# Altium project ESE516_ExampleBaseProject_V2.PrjPcb (part 1 of 2)
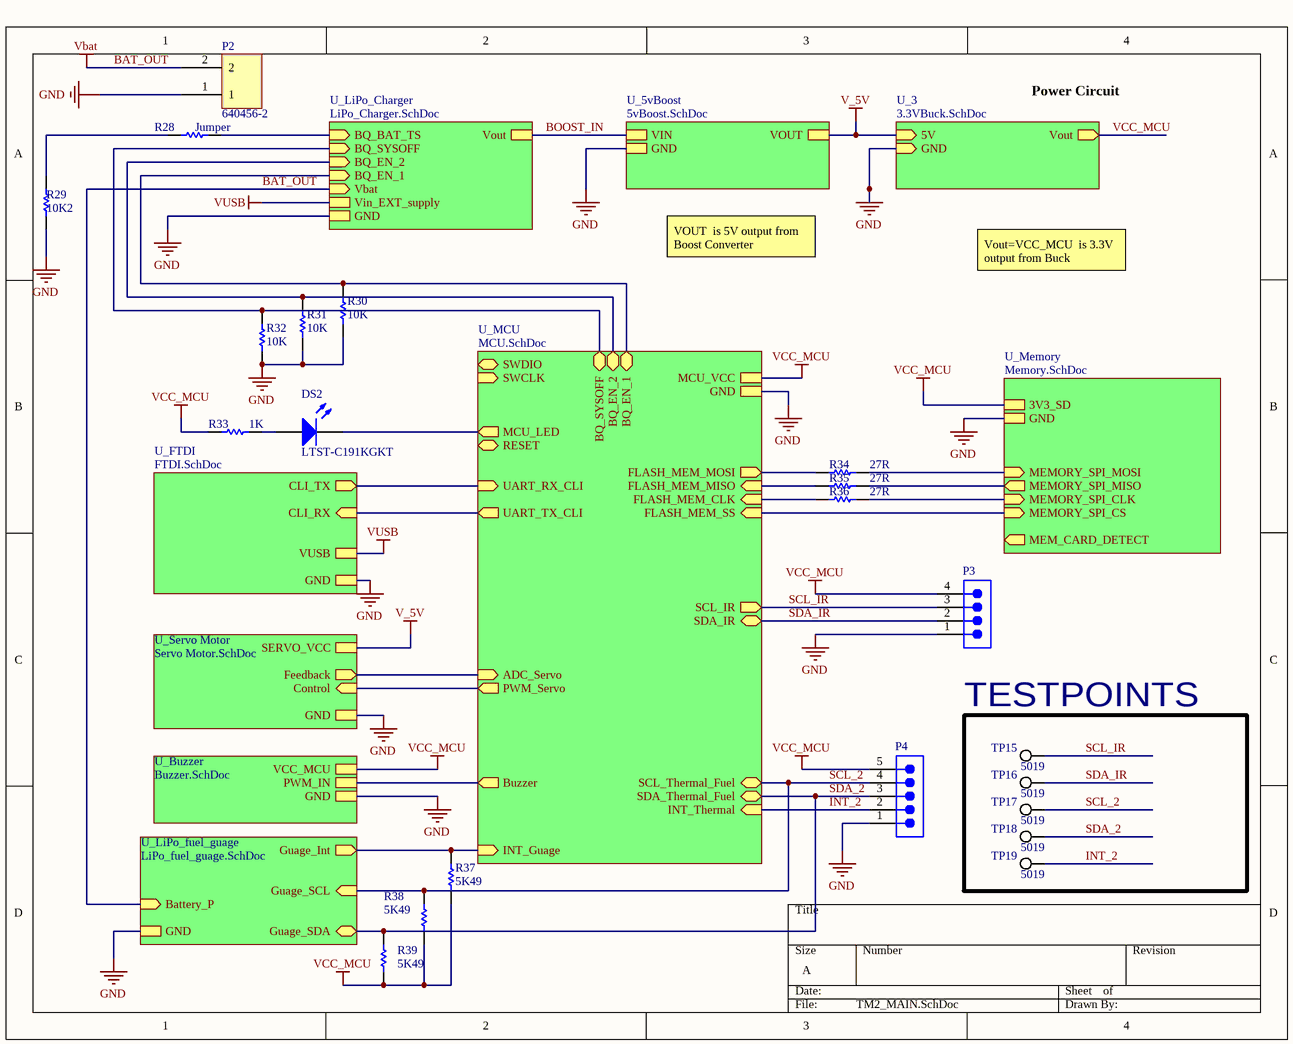
[diagram p0: TM2_MAIN.SchDoc]
10 sheets, 120 parts. Net scope: strictly hierarchical (ports join the sheet entries above them; power ports are local).
Sheets:
  TM2_MAIN.SchDoc
    U_FTDI = FTDI.SchDoc
    U_Memory = Memory.SchDoc
    U_5vBoost = 5vBoost.SchDoc
    U_3 = 3.3VBuck.SchDoc
    U_MCU = MCU.SchDoc
    U_Servo Motor = Servo Motor.SchDoc
    U_LiPo_Charger = LiPo_Charger.SchDoc
    U_LiPo_fuel_guage = LiPo_fuel_guage.SchDoc
    U_Buzzer = Buzzer.SchDoc

## Sheet TM2_MAIN.SchDoc
size A; DrawnBy: Eduardo

### Parts
DS2  LTST-C191KGKT  [LITE-ON-LTST-C191KRKT-2_V]
P2  640456-2  [640456-2]
P3  (no value)  [SMTC-MTSW-104-07-X-S-170]
P4  (no value)  [SMTC-MTLW-105-05-X-S-190]
R28  Jumper  [RESC0603(1608)_N]
R29  10K2  [RESC0805(2012)_L]
R30  10K  [RESC0805(2012)_L]
R31  10K  [RESC0805(2012)_L]
R32  10K  [RESC0805(2012)_L]
R33  1K  [RESC0603(1608)_M]
R34  27R  [RESC0603(1608)_N]
R35  27R  [RESC0603(1608)_N]
R36  27R  [RESC0603(1608)_N]
R37  5K49  [RESC0805(2012)_N]
R38  5K49  [RESC0805(2012)_N]
R39  5K49  [RESC0805(2012)_N]
TP15  5019  [KSTN-5019_V]
TP16  5019  [KSTN-5019_V]
TP17  5019  [KSTN-5019_V]
TP18  5019  [KSTN-5019_V]
TP19  5019  [KSTN-5019_V]

### Blocks framed on the sheet
TESTPOINTS: TP15-TP19

### Sub-sheets
U_3 = 3.3VBuck.SchDoc: 5V (in), GND (in), Vout (out)
U_5vBoost = 5vBoost.SchDoc: VOUT, VIN, GND
U_Buzzer = Buzzer.SchDoc: VCC_MCU, GND, PWM_IN
U_FTDI = FTDI.SchDoc: CLI_RX (in), CLI_TX (out), VUSB, GND
U_LiPo_Charger = LiPo_Charger.SchDoc: BQ_BAT_TS (in), BQ_SYSOFF (in), BQ_EN_2 (in), BQ_EN_1 (in), Vbat (in), Vout, GND, Vin_EXT_supply
U_LiPo_fuel_guage = LiPo_fuel_guage.SchDoc: Guage_SDA (bidir), Guage_SCL (in), Guage_Int (out), Battery_P (in), GND
U_MCU = MCU.SchDoc: SWDIO (bidir), SWCLK (in), UART_TX_CLI (out), FLASH_MEM_SS (in), FLASH_MEM_CLK (in), FLASH_MEM_MISO (in), FLASH_MEM_MOSI (out), RESET (bidir), MCU_LED (out), MCU_VCC, GND, INT_Thermal (in), SDA_IR (bidir), PWM_Servo (out), ADC_Servo (in), SCL_Thermal_Fuel (bidir), SDA_Thermal_Fuel (bidir), SCL_IR (out), UART_RX_CLI (in), BQ_SYSOFF (bidir), BQ_EN_1 (bidir), BQ_EN_2 (bidir), INT_Guage (in), Buzzer (out)
U_Memory = Memory.SchDoc: MEMORY_SPI_MOSI (in), MEMORY_SPI_MISO (out), MEMORY_SPI_CLK (in), MEMORY_SPI_CS (in), MEM_CARD_DETECT (out), GND, 3V3_SD
U_Servo Motor = Servo Motor.SchDoc: SERVO_VCC, Feedback (out), Control (in), GND

### Nets
BOOST_IN: sheet U_5vBoost/VIN, sheet U_LiPo_Charger/Vout  [project net Vin]
GND: P2.1 P3.1 P4.1 R29.1 R30.1 R31.2 R32.2 ; sheet U_FTDI/GND, sheet U_Memory/GND, sheet U_5vBoost/GND, sheet U_3/GND, sheet U_MCU/GND, sheet U_Servo Motor/GND, sheet U_LiPo_Charger/GND, sheet U_LiPo_fuel_guage/GND, sheet U_Buzzer/GND
V_5V: sheet U_5vBoost/VOUT, sheet U_3/5V, sheet U_Servo Motor/SERVO_VCC
Vbat: P2.2 ; sheet U_LiPo_Charger/Vbat, sheet U_LiPo_fuel_guage/Battery_P  [also labelled BAT_OUT]
VCC_MCU: P3.4 P4.5 R33.1 R37.1 R38.1 R39.1 ; sheet U_Memory/3V3_SD, sheet U_3/Vout, sheet U_MCU/MCU_VCC, sheet U_Buzzer/VCC_MCU
VUSB: sheet U_FTDI/VUSB, sheet U_LiPo_Charger/Vin_EXT_supply
BQ_BAT_TS: R28.2 ; sheet U_LiPo_Charger/BQ_BAT_TS
BQ_EN_1: R30.2 ; sheet U_MCU/BQ_EN_1, sheet U_LiPo_Charger/BQ_EN_1
BQ_EN_2: R31.1 ; sheet U_MCU/BQ_EN_2, sheet U_LiPo_Charger/BQ_EN_2
BQ_SYSOFF: R32.1 ; sheet U_MCU/BQ_SYSOFF, sheet U_LiPo_Charger/BQ_SYSOFF
Buzzer: sheet U_MCU/Buzzer, sheet U_Buzzer/PWM_IN
Control: sheet U_MCU/PWM_Servo, sheet U_Servo Motor/Control
Feedback: sheet U_MCU/ADC_Servo, sheet U_Servo Motor/Feedback
FLASH_MEM_SPI_SS: sheet U_Memory/MEMORY_SPI_CS, sheet U_MCU/FLASH_MEM_SS
Guage_Int: R37.2 ; sheet U_MCU/INT_Guage, sheet U_LiPo_fuel_guage/Guage_Int
INT_2: P4.2 TP19.1 ; sheet U_MCU/INT_Thermal
MCU_LED: DS2.2(K) ; sheet U_MCU/MCU_LED
MEM_SPI_CLK: R36.2 ; sheet U_Memory/MEMORY_SPI_CLK
MEM_SPI_MISO: R35.2 ; sheet U_Memory/MEMORY_SPI_MISO
MEM_SPI_MOSI: R34.2 ; sheet U_Memory/MEMORY_SPI_MOSI
SCL_2: P4.4 R38.2 TP17.1 ; sheet U_MCU/SCL_Thermal_Fuel, sheet U_LiPo_fuel_guage/Guage_SCL
SCL_IR: P3.3 TP15.1 ; sheet U_MCU/SCL_IR
SDA_2: P4.3 R39.2 TP18.1 ; sheet U_MCU/SDA_Thermal_Fuel, sheet U_LiPo_fuel_guage/Guage_SDA
SDA_IR: P3.2 TP16.1 ; sheet U_MCU/SDA_IR
SERCOM1_PAD2_SPI_MISO: R35.1 ; sheet U_MCU/FLASH_MEM_MISO
SERCOM1_PAD2_SPI_MOSI: R34.1 ; sheet U_MCU/FLASH_MEM_MOSI
SERCOM1_PAD3_SPI_SCK: R36.1 ; sheet U_MCU/FLASH_MEM_CLK
SERCOM4_UART_RX_CLI: sheet U_FTDI/CLI_TX, sheet U_MCU/UART_RX_CLI
SERCOM4_UART_TX_CLI: sheet U_FTDI/CLI_RX, sheet U_MCU/UART_TX_CLI
NetDS2_1: DS2.1(A) R33.2
NetR28_1: R28.1 R29.2

### Notes on the sheet
- Power Circuit
- VOUT  is 5V output from Boost Converter
- Vout=VCC_MCU  is 3.3V output from Buck Converter

### Library data of the parts
DS2 = CMP-2000-05198-1: Chip LED, Green, 574 nm, 40 pF, -55 to 85 degC, 2-Pin SMD, RoHS, Tape and Reel; Manufacturer: Lite-On; Rad Hardened: No; Emitting Color: YellowGreen; Product Height (mm): 0.55mm; Forward Voltage: 2.4V; Number of Elements: 1; Dominant Wave Length: 571nm; DELETED: Compliant; Viewing Angle: 130deg; High Brightness: Yes; Peak Wavelength: 574nm; Type: Uni-Color; Forward Current: 30mA; Product Length (mm): 1.6mm; Luminous Intensity: 35mcd; Test Current (It): 20mA; Chip Material: AlGaInP; Product Depth (mm): 0.8mm; Shape Type: Rectangular; Reverse Voltage: 5V; Power Dissipation: 75W; Pin Count: 2; Lens Dimensions: 1.1X0.8X0.37mm; Packaging: TapeandReel; Main Category: ChipLED; Operating Temperature Classification: Industrial; Package Type: ChipLed; Mounting: SurfaceMount; Lum Intensity: 35mcd; Operating Temp Range: -55Cto85C; Datasheet Version: Jan-07; Datasheet URL: http://download.siliconexpert.com/pdfs/2007/08/26/semi_b/manual/lot/ds/ltst-c191kgkt.pdf; Manufacturer URL: http://www.us.liteon.com/
P2 = 640456-2: CONN HEADER VERT 2POS .100 TIN; Manufacturer: TE Connectivity; Underplate Material: Nickel; Connector Type: Plug,Pin,Header; Contact Resistance: 6mR; Max Current Rating: 5A; Max Voltage Rating (AC): 250V; Number of Positions: 2; Backwall/Post Interruptions: No (Without); Connector System: Wire-to-Board; Plating Thickness: 3.81um; PCB Mount Retention: Without; Gender: Male; Contact Style: Straight; PCB Mounting Orientation: Vertical; Pitch: 2.54mm; Mating Post Length: 7.49mm; PCB Thickness: 0.063inch; Tail Length: 3.56mm; Approvals: CSA; Supplier 1: Digi-Key; Manufacturer Part Number: 640456-2; Stock 1: 141304; Pricing 1: 1=0.12, 10=0.117, 100=0.0724, 500=0.0599, 1000=0.0524, 5000=0.0449, 10000=0.0437 (USD); Mount: Through Hole; Colour: White,Natural,Beige; Contact Plating: Tin; Contact Material: Copper Alloy; Housing Colour: Natural; Housing Material: Polyester; Contact Shape: Square; Min Operating Temperature: -67°C; Max Operating Temperature: 221°C; Package Quantity: 5000; Packaging: Bulk; Termination: Solder; Number of Rows: 1; Fastening Type: Friction; Contact Gender: Male; Voltage Rating (AC): 250V; Number of Contacts: 2; Orientation: Straight; Contact Retention: No (Without); Mating Alignment: No (Without); Mating Retention: No (Without); PCB Mount Alignment: No (Without); Panel Mount Retention: No (Without); Sealable: No (Without); Strain Relief: No (Without); Current Rating: 5A; Number of Poles: 2; Voltage Rating: 250V; Working Voltage: 250V; Length: 5.08mm; Height: 7.87mm; Depth: 5.72mm; Lead Pitch: 2.54mm; Contact Mating Length: 0.295inch; Termination Post Length: 3.56mm; Radiation Hardening: No; ELV: Compliant; Lead Free: Lead Free; Flammability Rating: UL94 V-0; REACH SVHC: No SVHC; ComponentLink1URL: https://datasheet.ciiva.com/709/eng-cd-640456-w1-709680.pdf; ComponentLink1Description: https://datasheet.ciiva.com/709/eng-cd-640456-w1-709680.pdf; ComponentLink2URL: https://datasheet.ciiva.com/3118/eng-ds-82056-mta-0608-3118497.pdf; ComponentLink2Description: https://datasheet.ciiva.com/3118/eng-ds-82056-mta-0608-3118497.pdf; ComponentLink3URL: https://datasheet.ciiva.com/19462/613931-19462481.pdf; ComponentLink3Description: https://datasheet.ciiva.com/19462/613931-19462481.pdf; ComponentLink4URL: https://datasheet.ciiva.com/14156/04384301-14156820.pdf; ComponentLink4Description: https://datasheet.ciiva.com/14156/04384301-14156820.pdf; ComponentLink5URL: https://datasheet.ciiva.com/7128/1866390-7128742.pdf; ComponentLink5Description: https://datasheet.ciiva.com/7128/1866390-7128742.pdf; ComponentLink6URL: https://datasheet.ciiva.com/16401/eng-ds-82056-mta-0608-16401289.pdf; ComponentLink6Description: https://datasheet.ciiva.com/16401/eng-ds-82056-mta-0608-16401289.pdf; ComponentLink7URL: https://datasheet.ciiva.com/16505/eng-ds-82056-mta-0608-16505419.pdf; ComponentLink7Description: https://datasheet.ciiva.com/16505/eng-ds-82056-mta-0608-16505419.pdf; ComponentLink8URL: https://datasheet.ciiva.com/25617/0900766b80027008-25617244.pdf; ComponentLink8Description: https://datasheet.ciiva.com/25617/0900766b80027008-25617244.pdf; ComponentLink9URL: https://datasheet.ciiva.com/11746/0900766b80eb7fdd-11746365.pdf; ComponentLink9Description: https://datasheet.ciiva.com/11746/0900766b80eb7fdd-11746365.pdf; Supplier Part Number 1: A1921-ND
P3 = CMP-1024-00107-1: Manufacturer: Samtec; PartNumber: MTSW-104-07-L-S-170; Pitch: 2.54 mm; PackageVersion: BI, 2/1987; ComponentLink1URL: http://www.samtec.com; PackageReference: MTSW-104-07-X-S-170; ComponentLink3Description: Package Specification; Temperature Range: -55 to 125 degC; ComponentLink2URL: http://www.samtec.com/documents/webfiles/pdf/MTSW.PDF; RoHS: True; Orientation: Vertical; DatasheetVersion: F-214; Mounting Technology: Through-hole; ComponentLink1Description: Manufacturer URL; ComponentLink2Description: Datasheet; ComponentLink3URL: http://www.samtec.com/documents/webfiles/cpdf/MTSW-XXX-XX-X-X-XXXX-XX-XXX-MKT1.pdf
P4 = CMP-1024-00079-1: Manufacturer: Samtec; PartNumber: MTLW-105-05-L-S-190; Pitch: 2.54 mm; Mounting Technology: Through-hole; ComponentLink2Description: Datasheet; DatasheetVersion: F-214; Temperature Range: -55 to 125 degC; ComponentLink1Description: Manufacturer URL; Orientation: Vertical; ComponentLink2URL: http://www.samtec.com/documents/webfiles/pdf/MTLW_TH.PDF; PackageDescription: Low Profile Terminal Assembly; PackageVersion: T, 6/1991; RoHS: True; ComponentLink3Description: Package Specification; ComponentLink1URL: http://www.samtec.com; PackageReference: MTLW-105-05-X-S-190; ComponentLink3URL: http://www.samtec.com/documents/webfiles/cpdf/MTLW-1XX-XX-XX-X-XXX-XX-XX-MKT1.pdf
R28 = CMP-1012-00001-1: Jumper 0603 (1608 Metric); Case-Metric: 1608; Value: 0.00 Ohm; Power: None; Case-EIA: 0603; Technology: SMT; Tolerance: None
R29-R32 = CMP-1013-00624-1: 10K2 0.125W 1% 0805 (2012 Metric)  SMD; Case-Metric: 2012; Case-EIA: 0805; Value: 10200.00 Ohm; Technology: SMT; Tolerance: 1 %; Power: 0.125 W
R33 = CMP-1012-00510-1: 1K 0.1W 1% 0603 (1608 Metric)  SMD; Case-Metric: 1608; Case-EIA: 0603; Value: 1000.00 Ohm; Technology: SMT; Tolerance: 1 %; Power: 0.1 W
R34-R36 = CMP-1012-00331-1: 27R 0.1W 1% 0603 (1608 Metric)  SMD; Case-EIA: 0603; Value: 27.00 Ohm; Case-Metric: 1608; Technology: SMT; Tolerance: 1 %; Power: 0.1 W
R37-R39 = CMP-1013-00594-1: 5K49 0.125W 1% 0805 (2012 Metric)  SMD; Case-Metric: 2012; Value: 5490.00 Ohm; Case-EIA: 0805; Tolerance: 1 %; Power: 0.125 W; Technology: SMT
TP15-TP19 = CMP-1672-00008-1: Test Point, 1 Position SMD, RoHS, Tape and Reel; ComponentLink1Description: Manufacturer URL; Package Quantity: 1000; DatasheetVersion: 03/2014; Packaging: Tape and Reel; ComponentLink2URL: http://www.keyelco.com/product-pdf.cfm?p=1357; ComponentLink1URL: http://www.keyelco.com/; Mount: Surface Mount; Contact Plating: Silver; PackageDescription: 1-Pin Surface Mount Device, Body 3.81 x 2.03 mm; Pins: 1; RoHSCompliant: True; Mounting Technology: Surface Mount; ComponentLink2Description: Datasheet; PackageReference: 5019

## Sheet FTDI.SchDoc
size A
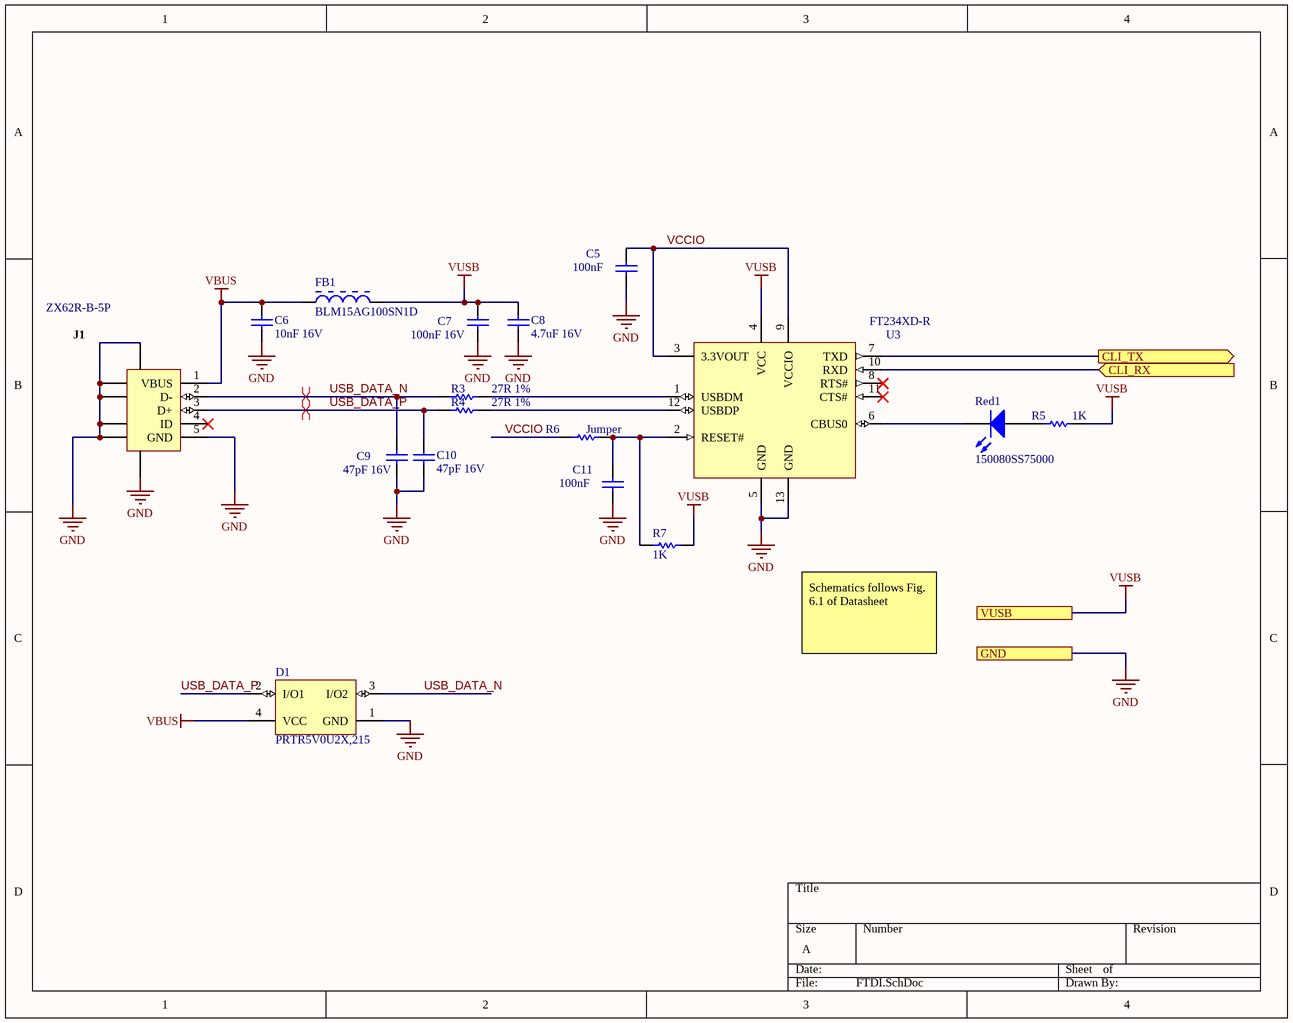
[diagram p1: FTDI.SchDoc]

### Parts
C5  100nF  [CAPC0402(1005)60_N]
C6  10nF 16V  [CAPC0603(1608)100_L]
C7  100nF 16V  [CAPC0603(1608)100_N]
C8  4.7uF 16V  [CAPC0805(2012)145_N]
C9  47pF 16V  [CAPC0603(1608)100_L]
C10  47pF 16V  [CAPC0603(1608)100_L]
C11  100nF  [CAPC0402(1005)60_N]
D1  PRTR5V0U2X,215  [NXP-SOT143B-4_V]
FB1  BLM15AG100SN1D  [MURA-BLM15-CHIP-2_V]
J1  ZX62R-B-5P  [HIRO-ZX62R-B-5P_V]
R3  27R 1%  [RESC0603(1608)_N]
R4  27R 1%  [RESC0603(1608)_N]
R5  1K  [RESC0603(1608)_M]
R6  Jumper  [RESC0603(1608)_N]
R7  1K  [RESC0603(1608)_M]
Red1  150080SS75000  [0805_A]
U3  FT234XD-R  [DFN-12_V]

### Ports
CLI_RX (in), CLI_TX (out), GND, VUSB

### Nets
GND: C5.1 C6.1 C7.1 C8.1 C9.1 C10.1 C11.1 D1.1(GND) J1.5(GND) J1.6(SHLD) J1.7(SHLD) J1.8(SHLD) J1.9(SHLD) J1.10(SHLD) J1.11(SHLD) U3.5(GND) U3.13(GND) ; port GND
VBUS: C6.2 D1.4(VCC) FB1.1 J1.1(VBUS)
VUSB: C7.2 C8.2 FB1.2 R5.2 R7.1 U3.4(VCC) ; port VUSB
SERCOM4_UART_RX_CLI: U3.7(TXD) ; port CLI_TX
SERCOM4_UART_TX_CLI: U3.10(RXD) ; port CLI_RX
USB_DATA_N: C9.2 D1.3(I/O2) J1.2(D-) R3.1
USB_DATA_P: C10.2 D1.2(I/O1) J1.3(D+) R4.1
VCCIO: C5.2 R6.1 U3.3(3.3VOUT) U3.9(VCCIO)
NetC11_2: C11.2 R6.2 R7.2 U3.2(RESET#)
NetR3_2: R3.2 U3.1(USBDM)
NetR4_2: R4.2 U3.12(USBDP)
NetR5_1: R5.1 Red1.2(A)
NetRed1_1: Red1.1(K) U3.6(CBUS0)

Not connected (* = marked no-connect by the designer): J1 4(ID)*; U3 8(RTS#)* 11(CTS#)*

### Layout directives
differential pair: USB_DATA_N, USB_DATA_P

### Notes on the sheet
- Schematics follows Fig. 6.1 of Datasheet

### Library data of the parts
C5 C11 = CMP-1034-02062-1: CAP 100nF 6.3V ±20% 0402 (1005 Metric) Thickness 0.6mm SMD; Case-EIA: 0402; Tolerance: Â±20%; Case-Metric: 1005; Value: 100nF; Technology: SMT; Max Thickness: 0.6 mm; Rated Voltage: 6.3 V
C6 = CMP-1035-02311-1: CAP 10nF 16V ±10% 0603 (1608 Metric) Thickness 1mm SMD; Case-EIA: 0603; Case-Metric: 1608; Tolerance: Â±10%; Rated Voltage: 16 V; Value: 10nF; Max Thickness: 1 mm; Technology: SMT
C7 = CMP-1035-02584-1: CAP 100nF 16V ±10% 0603 (1608 Metric) Thickness 1mm SMD; Tolerance: Â±10%; Case-EIA: 0603; Case-Metric: 1608; Technology: SMT; Max Thickness: 1 mm; Value: 100nF; Rated Voltage: 16 V
C8 = CMP-1036-04889-1: CAP 4.7uF 16V ±10% 0805 (2012 Metric) Thickness 1.45mm SMD; Case-EIA: 0805; Case-Metric: 2012; Tolerance: Â±10%; Technology: SMT; Value: 4.7uF; Rated Voltage: 16 V; Max Thickness: 1.45 mm
C9 C10 = CMP-1035-01048-1: CAP 47pF 16V ±0.5pF 0603 (1608 Metric) Thickness 1mm SMD; Case-EIA: 0603; Case-Metric: 1608; Tolerance: Â±0.5pF; Technology: SMT; Value: 47pF; Rated Voltage: 16 V; Max Thickness: 1 mm
D1 = CMP-2000-05285-1: Ultra Low Capacitance Double Rail-to-Rail ESD Protection Diode, 5.5 V, 1 pF, -40 to 85 degC, 4-Pin SOT143B, RoHS, Tape and Reel; Manufacturer: NXP Semiconductors; Capacitance Value: 16pF; Number of Elements: 1; Rad Hardened: No; Reverse Breakdown Voltage: 6V; Working Voltage (Max): 5.5V; Polarity: Uni-Directional; Configuration: Quad; Leakage Current: 0.1uA; Product Height (mm): 1mm; Suppressor Type: DiodeArrays; Product Length (mm): 3mm; Product Depth (mm): 1.4mm; ESD Protection Voltage: 8KV@ContactDisc; Package Type: SOT; Mounting: SurfaceMount; Packaging: TapeandReel; Datasheet Version: Rev. 02, 01/2008; Reverse Stand-off Voltage: 5.5V; Manufacturer URL: http://www.nxp.com/; Operating Temp Range: -40Cto85C; Operating Temperature Classification: Industrial; Working Voltage: 5.5V; Operating Temperature Min Deg. C: -40C; Datasheet URL: https://datasheet.ciiva.com/4479/prtr5v0u2x-102853-4479461.pdf; Leakage Current (Max): 0.1uA; Direction Type: Uni-Directional; Pin Count: 3+Tab; Operating Temperature Max Deg. C: 85C; Mounting Style: SurfaceMount; Package / Case: SOT
FB1 = CMP-0686-00176-3: Chip Ferrite Bead for General Use, 10 Ohm, 1000 mA, -55 to 125 degC, 1 x 0.5 x 0.55 mm SMD, Tape and Reel; Manufacturer: Murata; Impedance (at 100 MHz): 10 Ohm Typ.; Rated Current: 1000 mA; DC Resistance: 0.025 Ohm Max.; PackageDescription: 2-Pin Chip, Body 1 x 0.5 mm; DatasheetVersion: 08/2013; Mounting Technology: Surface Mount; ComponentLink2URL: http://www.murata.com/products/catalog/pdf/c31e.pdf; Packing: Tape and Reel; ComponentLink1URL: http://www.murata.com/; PartNumber: BLM15AG100SN1D; ComponentLink1Description: Manufacturer URL; Operating Temperature Range: -55 to 125 degC; ComponentLink2Description: Datasheet; ComponentLink3Description: Package Specification; PackageReference: BLM15-2; ComponentLink3URL: http://www.murata.com/products/catalog/pdf/c31e.pdf
J1 = CMP-0031-00001-1: Connector; USBMicro-B,Reverse type, SMT; 5 Position; Right Angle; DatasheetVersion: 08/2010; Operating Temperature: -30 to 85 degC; Mounting Technology: Surface Mount; PartNumber: ZX62R-B-5P; PackageReference: ZX62R-B-5P; ComponentLink2URL: http://www.hirose.co.jp/cataloge_hp/e24200011.pdf; ComponentLink1URL: http://www.hirose.com/â€Ž; ComponentLink2Description: Datasheet; PackageDescription: 5-Pin USB Micro-B R/A Connector; ComponentLink1Description: Manufacturer URL
R3 R4 = CMP-1012-00331-1: as R34 on sheet TM2_MAIN; Technology: SMT; Tolerance: 1 %; Power: 0.1 W
R5 R7 = CMP-1012-00510-1: as R33 on sheet TM2_MAIN; Technology: SMT; Tolerance: 1 %; Power: 0.1 W
R6 = CMP-1012-00001-1: as R28 on sheet TM2_MAIN; Technology: SMT; Tolerance: None
Red1 = CMP-1426-00010-1: SMD mono-color Chip LED, WL-SMCW, Super Red; Manufacturer: Wuerth Elektronik; PackageReference: 0805_A; ComponentLink2URL: http://katalog.we-online.com/led/datasheet/150080SS75000.pdf; ComponentLink1URL: http://www.we-online.com; Color: Super Red; ComponentLink2Description: Datasheet; ComponentLink1Description: Manufacturer URL; PartNumber: 150080SS75000
U3 = CMP-0248-00027-1: FT234XD USB to BASIC UART IC, -40 to +85 degC, 12-Pin DFN, Pb-Free, Tape and Reel; Manufacturer: FTDI; PackageReference: DFN-12; PackageVersion: Feb-13; DatasheetVersion: ver 1.1, Feb-2013; ComponentLink1URL: http://www.ftdichip.com/; PartNumber: FT234XD-R; ComponentLink2URL: http://www.ftdichip.com/Support/Documents/DataSheets/ICs/DS_FT234XD.pdf; ComponentLink1Description: Manufacturer URL; PackageDescription: 12-Pin Dual Flat No-Lead, 3 x 3 mm Body, 0.45 mm Pitch, Exposed Pad; ComponentLink2Description: Datasheet

## Sheet Memory.SchDoc
size A
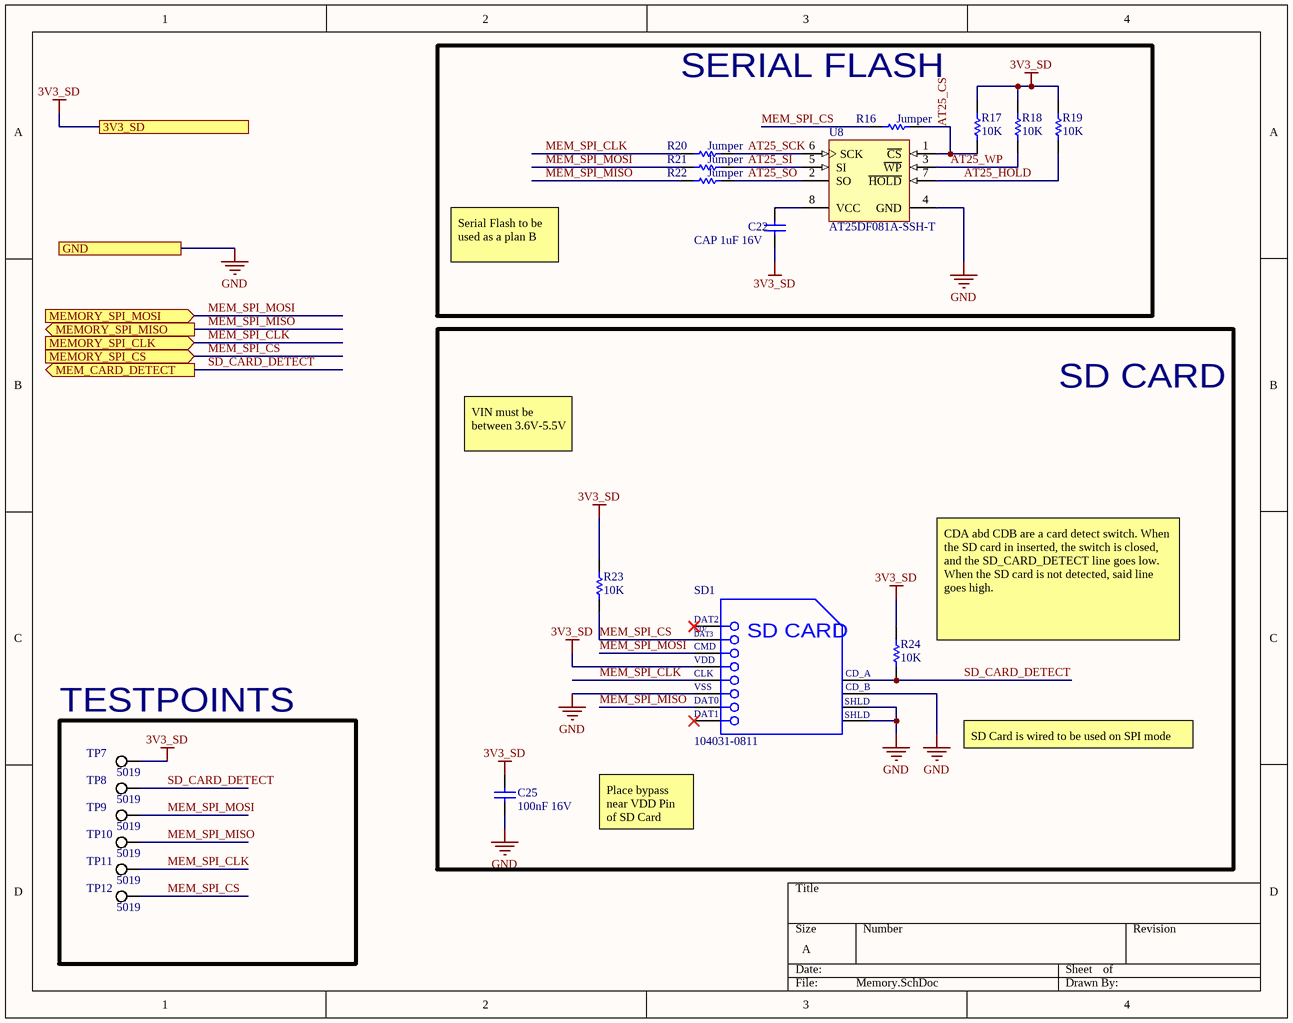
[diagram p2: Memory.SchDoc]

### Parts
C22  CAP 1uF 16V  [CAPC0603(1608)100_N]
C25  100nF 16V  [CAPC0603(1608)100_N]
R16  Jumper  [RESC0603(1608)_N]
R17  10K  [RESC0402(1005)_M]
R18  10K  [RESC0402(1005)_M]
R19  10K  [RESC0402(1005)_M]
R20  Jumper  [RESC0603(1608)_N]
R21  Jumper  [RESC0603(1608)_N]
R22  Jumper  [RESC0603(1608)_N]
R23  10K  [RESC0402(1005)_M]
R24  10K  [RESC0402(1005)_M]
SD1  104031-0811  [MOLX-104031-0811_V]
TP7  5019  [KSTN-5019_V]
TP8  5019  [KSTN-5019_V]
TP9  5019  [KSTN-5019_V]
TP10  5019  [KSTN-5019_V]
TP11  5019  [KSTN-5019_V]
TP12  5019  [KSTN-5019_V]
U8  AT25DF081A-SSH-T  [AT25DF081A-SSH-T]

### Blocks framed on the sheet
SERIAL FLASH: C22 R16-R22 U8
SD CARD: C25 R23 R24 SD1
TESTPOINTS: TP7-TP12

### Ports
3V3_SD, GND, MEM_CARD_DETECT (out), MEMORY_SPI_CLK (in), MEMORY_SPI_CS (in), MEMORY_SPI_MISO (out), MEMORY_SPI_MOSI (in)

### Nets
3V3_SD: C22.1 C25.2 R17.1 R18.1 R19.1 R23.1 R24.1 SD1.4(VDD) TP7.1 ; port 3V3_SD  [project net VCC_MCU]
GND: C25.1 SD1.6(VSS2) SD1.10(CD_B) SD1.11(SHLD1) SD1.12(SHLD2) U8.4(GND) ; port GND
AT25_CS: R16.2 R17.2 U8.1(~{CS})
AT25_HOLD: R19.2 U8.7(~{HOLD})
AT25_SCK: R20.2 U8.6(SCK)
AT25_SI: R21.2 U8.5(SI)
AT25_SO: R22.2 U8.2(SO)
AT25_WP: R18.2 U8.3(~{WP})
MEM_SPI_CLK: R20.1 SD1.5(CLK) TP11.1 ; port MEMORY_SPI_CLK
MEM_SPI_CS: R16.1 R23.2 SD1.2(CMD) TP12.1 ; port MEMORY_SPI_CS  [project net FLASH_MEM_SPI_SS]
MEM_SPI_MISO: R22.1 SD1.7(DAT0) TP10.1 ; port MEMORY_SPI_MISO
MEM_SPI_MOSI: R21.1 SD1.3(VSS1) TP9.1 ; port MEMORY_SPI_MOSI
SD_CARD_DETECT: R24.2 SD1.9(CD_A) TP8.1 ; port MEM_CARD_DETECT
NetC22_2: C22.2 U8.8(VCC)

Not connected (* = marked no-connect by the designer): SD1 1(CD/DAT3)* 8(DAT1)*

### Notes on the sheet
- Serial Flash to be used as a plan B
- VIN must be between 3.6V-5.5V
- (near R24) CDA abd CDB are a card detect switch. When the SD card in inserted, the switch is closed, and the SD_CARD_DETECT line goes low. When the SD card is not detected, said line goes high.
- SD Card is wired to be used on SPI mode
- Place bypass near VDD Pin of SD Card
- (in symbol CMP-2000-05825-1) DAT2; CD/; DAT3; SD CARD; VSS; SHLD

### Library data of the parts
C22 = CMP-1035-02737-1: CAP 1uF 16V ±10% 0603 (1608 Metric) Thickness 1mm SMD; Case-Metric: 1608; Tolerance: Â±10%; Case-EIA: 0603; Rated Voltage: 16 V; Max Thickness: 1 mm; Technology: SMT; Value: 1uF
C25 = CMP-1035-02584-1: as C7 on sheet FTDI; Technology: SMT; Max Thickness: 1 mm; Value: 100nF; Rated Voltage: 16 V
R16 R20-R22 = CMP-1012-00001-1: as R28 on sheet TM2_MAIN; Technology: SMT; Tolerance: None
R17-R19 R23 R24 = CMP-1011-00098-1: 10K 0.063W 5% 0402 (1005 Metric)  SMD; Case-Metric: 1005; Value: 10000.00 Ohm; Case-EIA: 0402; Technology: SMT; Tolerance: 5 %; Power: 0.063 W
SD1 = CMP-2000-05825-1: Micro SD Card, RA, -25 to 85 degC, 8-Pin SMD, RoHS, Tape and Reel; Voltage Rating: 10VAC/DC; Number of Contacts: 8; Insertion - Extraction Style: Push-Pull; Pitch: 1.1mm; Mating Cycles: 10000; Brand: Molex; Current Rating: 500mA; Manufacturer URL: http://www.molex.com/; Card Type: microSD; Mounting Type: Standard; Height: 1.42mm; Mounting Technology: SurfaceMount; Contact Plating: Gold; Product Category: MemoryCardConnectors; Package Description: 8-Pin Surface Mount Device, Body 11.95 x 11.4 mm, Pitch 1.1 mm; Datasheet URL: http://www.molex.com/pdm_docs/sd/1040310811_sd.pdf; Termination Style: SMD; Length: 11.4mm; Housing Material: LiquidCrystalPolymer(LCP); Orientation: RightAngle; RoHS: True; Contact Material: PhosphorBronze; Datasheet Version: Rev. E, 04/2006; Packaging: Reel; Manufacturer: Molex; Series: 104031; Product: CardConnectors; Number of Rows: 1Row; Package Reference: 104031-0811
TP7-TP12 = CMP-1672-00008-1: as TP15 on sheet TM2_MAIN; ComponentLink1Description: Manufacturer URL; Package Quantity: 1000; DatasheetVersion: 03/2014; Packaging: Tape and Reel; ComponentLink2URL: http://www.keyelco.com/product-pdf.cfm?p=1357; ComponentLink1URL: http://www.keyelco.com/; Mount: Surface Mount; Contact Plating: Silver; PackageDescription: 1-Pin Surface Mount Device, Body 3.81 x 2.03 mm; Pins: 1; RoHSCompliant: True; Mounting Technology: Surface Mount; ComponentLink2Description: Datasheet; PackageReference: 5019
U8 = AT25DF081A-SSH-T: IC FLASH 8MBIT 100MHZ 8SOIC; Manufacturer: Adesto Technologies; Memory Size: 8M (4096 pages x 256 bytes); Interface: SPI, RapidS; Voltage - Supply: 2.7 V ~ 3.6 V; Rad Hard: No; Manufacturer Part Number: AT25DF081A-SSH-T; RoHS: RoHS Compliant; Category: Integrated Circuits (ICs); Packaging: Cut Tape (CT); Part Status: Active; Format - Memory: FLASH; Memory Type: FLASH; Speed: 100MHz; Operating Temperature: -40°C ~ 85°C (TC); Package / Case: 8-SOIC (0.154", 3.90mm Width); Supplier Device Package: 8-SOIC; ComponentLink1URL: http://www.adestotech.com/wp-content/uploads/doc8715.pdf; ComponentLink1Description: http://www.adestotech.com/wp-content/uploads/doc8715.pdf; Supplier 1: Digikey; Stock 1: 2550; Pricing 1: 1=1.18, 10=1.081, 25=1.0516, 50=1.0462, 100=0.9352, 250=0.9324, 500=0.9185, 1000=0.8791 (USD); Package: 8SOIC; ComponentLink2URL: https://datasheet.ciiva.com/14084/doc8715-14084443.pdf; ComponentLink2Description: https://datasheet.ciiva.com/14084/doc8715-14084443.pdf; ComponentLink3URL: https://datasheet.ciiva.com/26910/getdatasheetpartid-730210-26910875.pdf; ComponentLink3Description: https://datasheet.ciiva.com/26910/getdatasheetpartid-730210-26910875.pdf; ComponentLink4URL: https://datasheet.ciiva.com/12251/doc8715-12251468.pdf; ComponentLink4Description: https://datasheet.ciiva.com/12251/doc8715-12251468.pdf; Supplier Part Number 1: 1265-1166-1-ND

## Sheet 5vBoost.SchDoc
size A
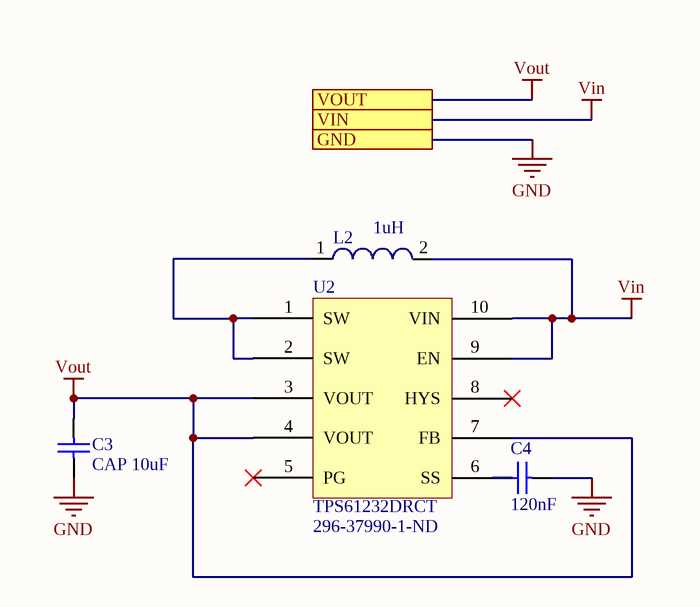
[diagram p3: 5vBoost.SchDoc]

### Parts
C3  CAP 10uF  [CAPC0805(2012)145_L]
C4  120nF  [CAPC2013X140X50ML20T25]
L2  1uH  [SMD 2510]
U2  TPS61232DRCT  Supplier Part Number 1: 296-37990-1-ND  [*SON50P300X300X100-10N]

### Ports
GND, VIN, VOUT

### Nets
GND: C3.1 C4.2 ; port GND
Vin: L2.2 U2.9(EN) U2.10(VIN) ; port VIN
Vout: C3.2 U2.3(VOUT) U2.4(VOUT) U2.7(FB) ; port VOUT  [project net V_5V]
NetC4_1: C4.1 U2.6(SS)
NetL2_1: L2.1 U2.1(SW) U2.2(SW)

Not connected (* = marked no-connect by the designer): U2 5(PG)* 8(HYS)*

### Library data of the parts
C3 = CMP-1036-04927-1: CAP 10uF 16V ±10% 0805 (2012 Metric) Thickness 1.45mm SMD; Case-EIA: 0805; Tolerance: Â±10%; Case-Metric: 2012; Rated Voltage: 16 V; Technology: SMT; Value: 10uF; Max Thickness: 1.45 mm
C4 = CMP-2007-04709-1: Manufacturer: AVX Interconnect / Elco; Part Number: 08055C124KAT2A
L2 = CMP-1411-00009-1: Power Multilayer Inductor WE-MAPI, L=1.0µH; Manufacturer: Wuerth Elektronik; PartNumber: 74438323010; Inductance: 1.0ÂµH; ComponentLink2URL: http://katalog.we-online.de/kataloge/eisos/media/pdf/74438323010.pdf; ComponentLink1URL: http://www.we-online.com; PackageReference: SMD 2510; ComponentLink2Description: Datasheet; ComponentLink1Description: Manufacturer URL
U2 = TPS61232DRCT: Manufacturer: Texas Instruments; Min Input Voltage: 2.3V; Max Input Voltage: 5.5V; Output Current: 2.1A; Number of Outputs: 1; Output Voltage: 5V; Efficiency: 96%; Switching Frequency: 2MHz; Quiescent Current: 35uA; Topology: Boost; Output Type: Fixed; Synchronous Rectifier: Yes; Output Configuration: Positive; Supplier 1: Digi-Key; Manufacturer Part Number: TPS61232DRCT; RoHS: Yes; Stock 1: 5502; Pricing 1: 1 = 2.92000, 10 = 2.62600, 100 = 2.11050 (USD); Mount: Surface Mount; Number of Pins: 10; Weight: 0.000921oz; Contact Plating: Gold; Min Operating Temperature: -40°C; Max Operating Temperature: 85°C; Max Output Current: 2.1A; Operating Supply Voltage: 5.5V; Nominal Output Voltage: 5V; Packaging: Tape and Reel; Min Output Voltage: 5V; Operating Supply Current: 35uA; Package Quantity: 250; Min Supply Voltage: 2.3V; Lead Free: Lead Free; REACH SVHC: No SVHC; ComponentLink1URL: http://www.farnell.com/datasheets/1902710.pdf?src-supplier=Element14; ComponentLink1Description: http://www.farnell.com/datasheets/1902710.pdf?src-supplier=Element14

## Sheet 3.3VBuck.SchDoc
size A
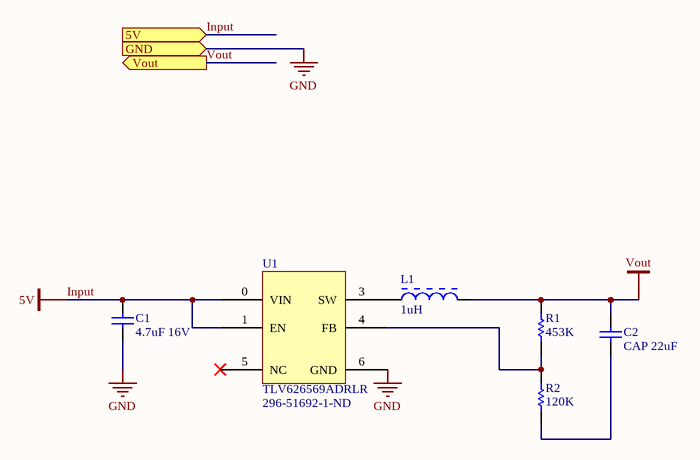
[diagram p4: 3.3VBuck.SchDoc]

### Parts
C1  4.7uF 16V  [CAPC0805(2012)145_N]
C2  CAP 22uF  [CAPC0805(2012)100_L]
L1  1uH  [BOUR-SDR0403-2_V]
R1  453K  [RESC0805(2012)_M]
R2  120K  [RESC0805(2012)_N]
U1  TLV626569ADRLR  Supplier Part Number 1: 296-51692-1-ND  [*SOT50P160X60-6N]

### Ports
5V (in), GND (in), Vout (out)

### Nets
5V: C1.2 U1.0(VIN) U1.1(EN) ; port 5V  [also labelled Input]  [project net V_5V]
GND: C1.1 U1.6(GND) ; port GND
Vout: C2.2 L1.2 R1.2 ; port Vout  [project net VCC_MCU]
NetC2_1: C2.1 R2.1
NetL1_1: L1.1 U1.3(SW)
NetR1_1: R1.1 R2.2 U1.4(FB)

Not connected (* = marked no-connect by the designer): U1 5(NC)*

### Library data of the parts
C1 = CMP-1036-04889-1: as C8 on sheet FTDI; Technology: SMT; Value: 4.7uF; Rated Voltage: 16 V; Max Thickness: 1.45 mm
C2 = CMP-1036-04944-1: CAP 22uF 10V ±20% 0805 (2012 Metric) Thickness 1mm SMD; Case-Metric: 2012; Case-EIA: 0805; Tolerance: Â±20%; Technology: SMT; Max Thickness: 1 mm; Value: 22uF; Rated Voltage: 10 V
L1 = CMP-0904-00016-1: SDR0403 Series Power Inductor, 1 uF +/- 20 %, 0.033 Ohm, -40 to 125 degC, 2-Pin SMD, RoHS, Tape and Reel; Manufacturer: Bourns; PartNumber: SDR0403-1R0ML; RDC (Ohm): 0.033 Max.; SRF (MHz): 150 Min.; I sat (A): 5.5 Typ.; Test Frequency (MHz): 7.96; Tolerance (%): +/- 20; Inductance (uH): 1; Q: 28; I rms (A): 3.8 Max.; PackageDescription: 3-Pin SMD, Dia 4.5 mm, Height 3.5 mm; Packing: Tape and Reel; PackageReference: SDR0403-2; ComponentLink1Description: Manufacturer URL; Temperature Range: -40 to 125 degC; DatasheetVersion: Feb-12; ComponentLink1URL: http://www.bourns.com/; RoHS: TRUE; Mounting Technology: Surface Mount; ComponentLink2Description: Datasheet; ComponentLink2URL: http://www.bourns.com/data/global/pdfs/sdr0403.pdf
R1 = CMP-1013-00810-1: 453K 0.125W 1% 0805 (2012 Metric)  SMD; Value: 453000.00 Ohm; Case-Metric: 2012; Case-EIA: 0805; Tolerance: 1 %; Power: 0.125 W; Technology: SMT
R2 = CMP-1013-00124-1: 120K 0.125W 5% 0805 (2012 Metric)  SMD; Case-Metric: 2012; Value: 120000.00 Ohm; Case-EIA: 0805; Power: 0.125 W; Technology: SMT; Tolerance: 5 %
U1 = TLV626569ADRLR: Manufacturer: Texas Instruments; Manufacturer Part Number: TLV62569ADRLR; Supplier 1: Digi-Key; Stock 1: 1873; Pricing 1: 1 = 1.32000, 10 = 1.17600, 100 = 0.91680, 500 = 0.75736, 1000 = 0.59792 (USD)

## Sheet MCU.SchDoc
size A
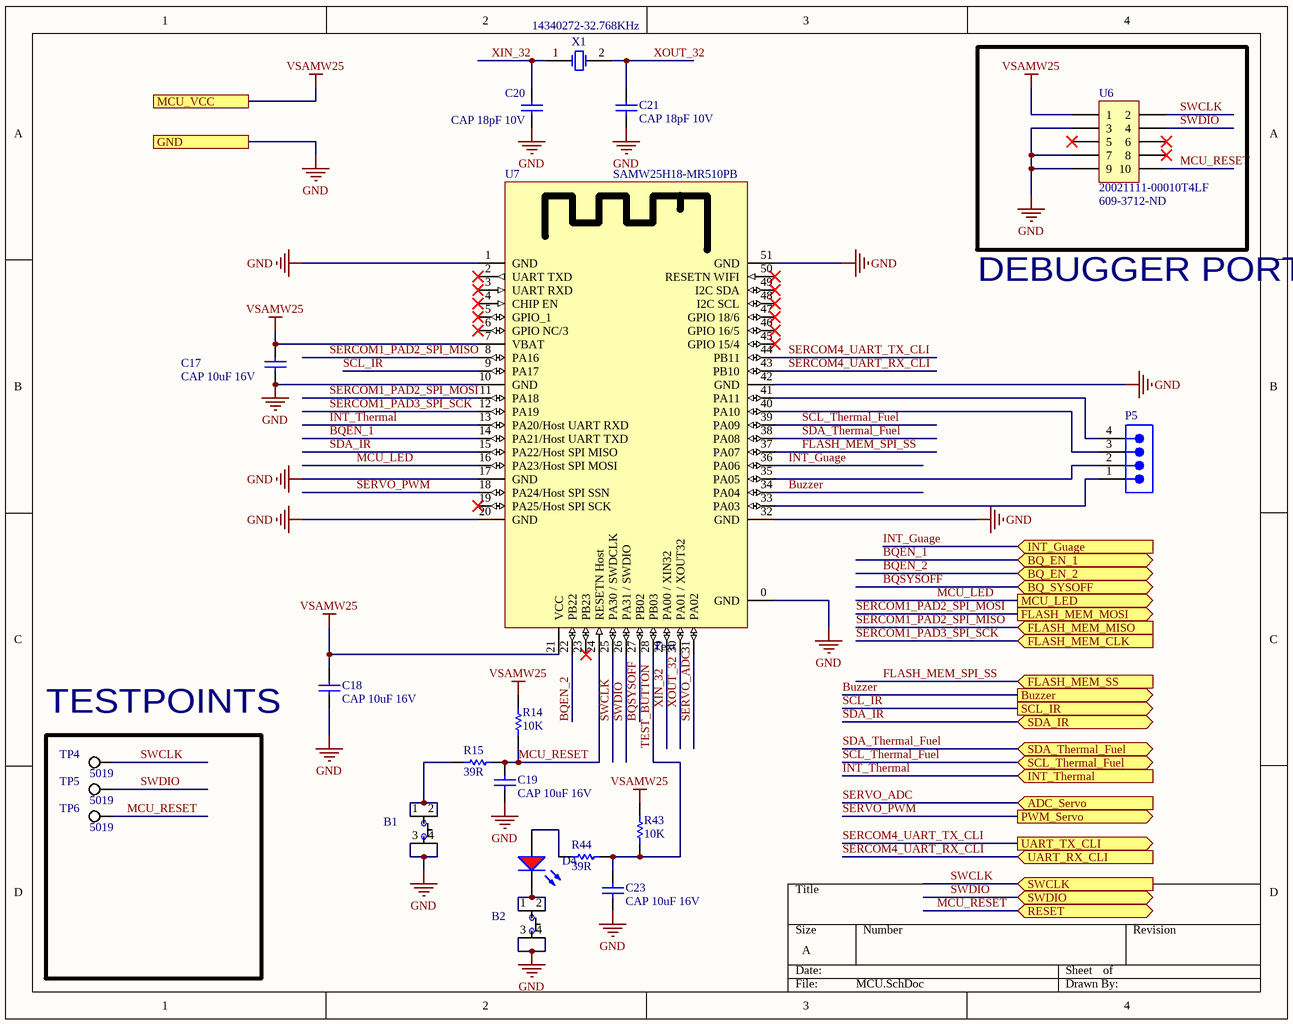
[diagram p5: MCU.SchDoc]

### Parts
B1  PTS810 SJK 250 SMTR LFS  [PTS810 SJK 250 SMTR LFS]  (value not drawn)
B2  PTS810 SJK 250 SMTR LFS  [PTS810 SJK 250 SMTR LFS]  (value not drawn)
C17  CAP 10uF 16V  [CAPC0805(2012)145_L]
C18  CAP 10uF 16V  [CAPC0805(2012)145_L]
C19  CAP 10uF 16V  [CAPC0805(2012)145_L]
C20  CAP 18pF 10V  [CAPC0805(2012)75_L]
C21  CAP 18pF 10V  [CAPC0805(2012)75_L]
C23  CAP 10uF 16V  [CAPC0805(2012)145_L]
D4  (no value)  [LTST-C170CKT_V]
P5  (no value)  [SMTC-MTSW-104-07-X-S-170]
R14  10K  [RESC0402(1005)_M]
R15  39R  [RESC0805(2012)_N]
R43  10K  [RESC0402(1005)_M]
R44  39R  [RESC0805(2012)_N]
TP4  5019  [KSTN-5019_V]
TP5  5019  [KSTN-5019_V]
TP6  5019  [KSTN-5019_V]
U6  20021111-00010T4LF  Supplier Part Number 1: 609-3712-ND  [20021111-00010T4LF]
U7  SAMW25H18-MR510PB  [SAMW25H18-MR510PB]
X1  14340272-32.768KHz  [ITTI-14340272-32.768KHz-2_V]

### Blocks framed on the sheet
TESTPOINTS: TP4-TP6

### Ports
ADC_Servo (in), BQ_EN_1 (bidir), BQ_EN_2 (bidir), BQ_SYSOFF (bidir), Buzzer (out), FLASH_MEM_CLK (in), FLASH_MEM_MISO (in), FLASH_MEM_MOSI (out), FLASH_MEM_SS (in), GND, INT_Guage (in), INT_Thermal (in), MCU_LED (out), MCU_VCC, PWM_Servo (out), RESET (bidir), SCL_IR (out), SCL_Thermal_Fuel (bidir), SDA_IR (bidir), SDA_Thermal_Fuel (bidir), SWCLK (in), SWDIO (bidir), UART_RX_CLI (in), UART_TX_CLI (out)

### Nets
GND: B1.3 B1.4 B2.3 B2.4 C17.1 C18.1 C19.1 C20.2 C21.2 C23.1 U6.3 U6.7 U6.9 U7.0(GND) U7.1(GND) U7.10(GND) U7.17(GND) U7.20(GND) U7.32(GND) U7.42(GND) U7.51(GND) ; port GND
VSAMW25: C17.2 C18.2 R14.1 R43.1 U6.1 U7.7(VBAT) U7.21(VCC) ; port MCU_VCC  [project net VCC_MCU]
BQEN_1: U7.14(PA21/Host_UART_TXD) ; port BQ_EN_1  [project net BQ_EN_1]
BQEN_2: U7.22(PB22) ; port BQ_EN_2  [project net BQ_EN_2]
BQSYSOFF: U7.27(PB02) ; port BQ_SYSOFF  [project net BQ_SYSOFF]
Buzzer: U7.34(PA04) ; port Buzzer
FLASH_MEM_SPI_SS: U7.37(PA07) ; port FLASH_MEM_SS
INT_Guage: U7.36(PA06) ; port INT_Guage  [project net Guage_Int]
INT_Thermal: U7.13(PA20/Host_UART_RXD) ; port INT_Thermal  [project net INT_2]
MCU_LED: U7.16(PA23/Host_SPI_MOSI) ; port MCU_LED
MCU_RESET: C19.2 R14.2 R15.1 TP6.1 U6.10 U7.24(RESETN_Host) ; port RESET
SCL_IR: U7.9(PA17) ; port SCL_IR
SCL_Thermal_Fuel: U7.39(PA09) ; port SCL_Thermal_Fuel  [project net SCL_2]
SDA_IR: U7.15(PA22/Host_SPI_MISO) ; port SDA_IR
SDA_Thermal_Fuel: U7.38(PA08) ; port SDA_Thermal_Fuel  [project net SDA_2]
SERCOM1_PAD2_SPI_MISO: U7.8(PA16) ; port FLASH_MEM_MISO
SERCOM1_PAD2_SPI_MOSI: U7.11(PA18) ; port FLASH_MEM_MOSI
SERCOM1_PAD3_SPI_SCK: U7.12(PA19) ; port FLASH_MEM_CLK
SERCOM4_UART_RX_CLI: U7.43(PB10) ; port UART_RX_CLI
SERCOM4_UART_TX_CLI: U7.44(PB11) ; port UART_TX_CLI
SERVO_ADC: U7.31(PA02) ; port ADC_Servo  [project net Feedback]
SERVO_PWM: U7.18(PA24/Host_SPI_SSN) ; port PWM_Servo  [project net Control]
SWCLK: TP4.1 U6.2 U7.25(PA30_/_SWDCLK) ; port SWCLK
SWDIO: TP5.1 U6.4 U7.26(PA31_/_SWDIO) ; port SWDIO
TEST_BUTTON: C23.2 R43.2 R44.1 U7.28(PB03)
XIN_32: C20.1 U7.29(PA00_/_XIN32) X1.1(X1)
XOUT_32: C21.1 U7.30(PA01_/_XOUT32) X1.2(X2)
NetB1_1: B1.1 B1.2 R15.2
NetB2_1: B2.1 B2.2 D4.C
NetD4_A: D4.A R44.2
NetP5_1: P5.1 U7.33(PA03)
NetP5_2: P5.2 U7.35(PA05)
NetP5_3: P5.3 U7.40(PA10)
NetP5_4: P5.4 U7.41(PA11)

Not connected (* = marked no-connect by the designer): U6 5* 6* 8*; U7 2(UART_TXD)* 3(UART_RXD)* 4(CHIP_EN)* 5(GPIO_1)* 6(GPIO_NC/3)* 19(PA25/Host_SPI_SCK)* 23(PB23)* 45(GPIO_15/4)* 46(GPIO_16/5)* 47(GPIO_18/6)* 48(I2C_SCL)* 49(I2C_SDA)* 50(RESETN_WIFI)*

### Notes on the sheet
- DEBUGGER PORT
- (near U7) Text

### Library data of the parts
B1 B2 = PTS810 SJK 250 SMTR LFS: SWITCH TACTILE SPST-NO 0.05A 16V Tactile Switch SPST-NO Top Actuated Surface Mount; Manufacturer: ITT /  C&K Components; Part # Aliases: Y97LT25B5DBFP; Operating Force: 2.6 N; Actuator: Oval; Current Rating: 50 mA; Voltage Rating DC: 16 VDC; Contact Form: SPST; Switch Function: OFF - (ON); Mounting Direction: Straight; Stem Height: 2.5 mm; Brand: C&K Components; Travel: 0.15 mm; Manufacturer Part Number: PTS810SJK250SMTRLFS; Product Category: Tactile Switches; RoHS: Details; Termination Style: J Form Lead; Mounting Style: SMD/SMT; Color: White; Packaging: Reel; Contact Plating: Silver; Operating Temperature Range: - 40 C to + 85 C; Series: PTS810; Factory Pack Quantity: 2900; ComponentLink1URL: https://datasheet.ciiva.com/18514/pts810-4mar13-18514061.pdf; ComponentLink1Description: https://datasheet.ciiva.com/18514/pts810-4mar13-18514061.pdf; ComponentLink2URL: https://datasheet.ciiva.com/18514/pts810-4mar13-18514062.pdf; ComponentLink2Description: https://datasheet.ciiva.com/18514/pts810-4mar13-18514062.pdf; ComponentLink3URL: https://datasheet.ciiva.com/18514/pts810-4mar13-18514063.pdf; ComponentLink3Description: https://datasheet.ciiva.com/18514/pts810-4mar13-18514063.pdf; Supplier 1: Digi-Key; Supplier Part Number 1: CKN10503CT-ND
C17-C19 C23 = CMP-1036-04927-1: as C3 on sheet 5vBoost; Rated Voltage: 16 V; Technology: SMT; Value: 10uF; Max Thickness: 1.45 mm
C20 C21 = CMP-1036-01106-1: CAP 18pF 10V ±1% 0805 (2012 Metric) Thickness 0.75mm SMD; Tolerance: Â±1%; Case-Metric: 2012; Case-EIA: 0805; Technology: SMT; Rated Voltage: 10 V; Value: 18pF; Max Thickness: 0.75 mm
D4 = CMP-1674-00001-3: LED RED CLEAR 0805 SMD; Manufacturer: Lite-On; PartNumber: LTST-C170CKT; PackageReference: C170CKT; ComponentLink1Description: Datasheet; ComponentLink1URL: http://media.digikey.com/pdf/Data%20Sheets/Lite-On%20PDFs/LTST-C170CKT.pdf
P5 = CMP-1024-00107-1: as P3 on sheet TM2_MAIN; PackageVersion: BI, 2/1987; ComponentLink1URL: http://www.samtec.com; PackageReference: MTSW-104-07-X-S-170; ComponentLink3Description: Package Specification; Temperature Range: -55 to 125 degC; ComponentLink2URL: http://www.samtec.com/documents/webfiles/pdf/MTSW.PDF; RoHS: True; Orientation: Vertical; DatasheetVersion: F-214; Mounting Technology: Through-hole; ComponentLink1Description: Manufacturer URL; ComponentLink2Description: Datasheet; ComponentLink3URL: http://www.samtec.com/documents/webfiles/cpdf/MTSW-XXX-XX-X-X-XXXX-XX-XXX-MKT1.pdf
R14 R43 = CMP-1011-00098-1: as R17 on sheet Memory; Technology: SMT; Tolerance: 5 %; Power: 0.063 W
R15 R44 = CMP-1013-00040-1: 39R 0.125W 5% 0805 (2012 Metric)  SMD; Value: 39.00 Ohm; Case-EIA: 0805; Case-Metric: 2012; Technology: SMT; Power: 0.125 W; Tolerance: 5 %
TP4-TP6 = CMP-1672-00008-1: as TP15 on sheet TM2_MAIN; ComponentLink1Description: Manufacturer URL; Package Quantity: 1000; DatasheetVersion: 03/2014; Packaging: Tape and Reel; ComponentLink2URL: http://www.keyelco.com/product-pdf.cfm?p=1357; ComponentLink1URL: http://www.keyelco.com/; Mount: Surface Mount; Contact Plating: Silver; PackageDescription: 1-Pin Surface Mount Device, Body 3.81 x 2.03 mm; Pins: 1; RoHSCompliant: True; Mounting Technology: Surface Mount; ComponentLink2Description: Datasheet; PackageReference: 5019
U6 = 20021111-00010T4LF: CONN HEADER 10POS UNSHD VERT T/H; Manufacturer: Amphenol / FCI; Stack Height: 2.5 mm; Number of Positions / Contacts: 10; Brand: FCI; Pitch: 1.27 mm; Mounting Angle: Vertical; Current Rating: 10 A; Mating Post Length: 3.05 mm; Voltage Rating: 125 V; Manufacturer Part Number: 20021111-00010T4LF; Mounting Style: Through Hole; Product Category: Headers & Wire Housings; RoHS: Details; Series: Minitek; Product Type: Headers; Type: Unshrouded; Number of Positions: 10; Number of Rows: 2; Contact Plating: Gold; Housing Material: Plastic; Termination Style: Through Hole; Contact Material: Nickel; Packaging: Tube; Factory Pack Quantity: 93; Termination Post Length: 2.3 mm; ComponentLink1URL: https://datasheet.ciiva.com/1433/1079612-1433267.pdf; ComponentLink1Description: https://datasheet.ciiva.com/1433/1079612-1433267.pdf; ComponentLink2URL: https://datasheet.ciiva.com/409/20021111-409158.pdf; ComponentLink2Description: https://datasheet.ciiva.com/409/20021111-409158.pdf; ComponentLink3URL: https://datasheet.ciiva.com/5131/20021111-5131386.pdf; ComponentLink3Description: https://datasheet.ciiva.com/5131/20021111-5131386.pdf; ComponentLink4URL: https://datasheet.ciiva.com/9465/20021111-9465402.pdf; ComponentLink4Description: https://datasheet.ciiva.com/9465/20021111-9465402.pdf; Supplier 1: Digi-Key
U7 = SAMW25H18-MR510PB: RF TXRX MODULE WIFI TRACE ANT; Manufacturer: Atmel; Manufacturer Part Number: ATSAMW25H18-MR510PB; Protocol: 802.11b/g/n; Frequency: 2.4GHz; Data Rate: 65Mbps; Power - Output: 17dBm; Sensitivity: -95.5dBm; Serial Interfaces: SPI, UART; Antenna Type: Integrated, Trace; Memory Size: 256kB Flash, 32kB SRAM; Voltage - Supply: 2.7 V ~ 4.2 V; Category: RF/IF and RFID; Family: RF Transceiver Modules; Series: Xplained Pro; Packaging: Tray; RF Family/Standard: WiFi; Modulation: -; Current - Receiving: -; Current - Transmitting: -; Mounting Type: Surface Mount; Operating Temperature: -40°C ~ 85°C; Package / Case: Module; ComponentLink1URL: http://www.atmel.com/devices/ATSAMW25.aspx; ComponentLink1Description: http://www.atmel.com/devices/ATSAMW25.aspx; ComponentLink2URL: http://www.farnell.com/datasheets/1965115.pdf; ComponentLink2Description: http://www.farnell.com/datasheets/1965115.pdf; Supplier 1: Digikey; Stock 1: 120; Pricing 1: 1=19.14 (USD); Supplier Part Number 1: ATSAMW25H18-MR510PB-ND
X1 = CMP-0463-00001-2: Crystal, 32.768 KHz, -40 to 85 degC, 3.2 x 1.5 x 0.9 mm SMD; Manufacturer: ITTI; Load Capacitance: 12.5 pF; Frequency Tolerance: +/-20 ppm; Drive Level: 1 max. uw; Nominal Frequency: 32.768KHz; Mounting Technology: Surface Mount; Operating temperature: -40 to 85 degC; PartNumber: 14340272-32.768KHz; ComponentLink1URL: http://www.itti-co.com; ComponentLink1Description: Manufacturer URL; PackageReference: 14340272-32.768KHz-2; PackageDescription: 2-Pin Hand Drawn, Body 3.2 x 1.5mm, Pitch 2.5 mm

## Sheet Servo Motor.SchDoc
size A
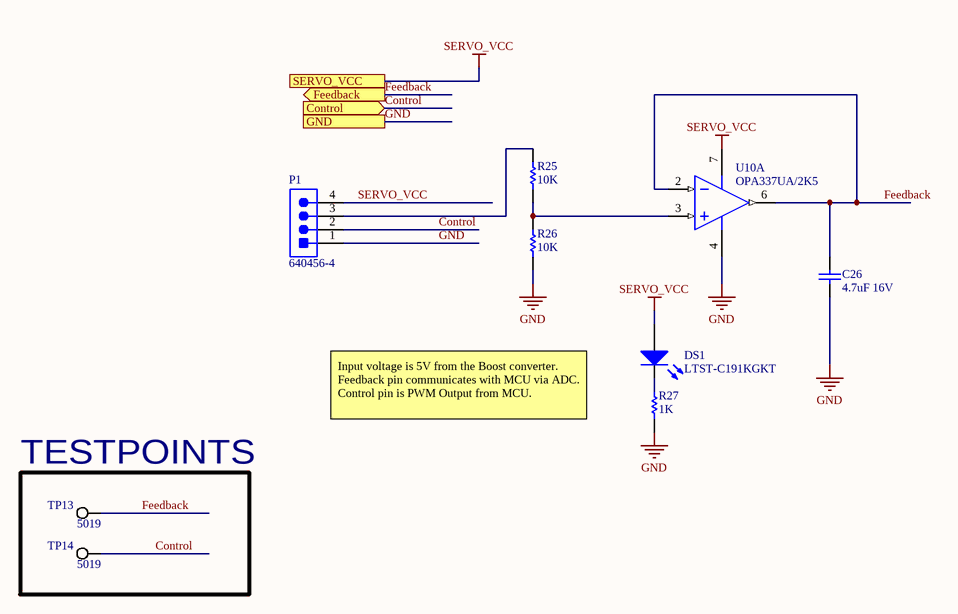
[diagram p6: Servo Motor.SchDoc]

### Parts
C26  4.7uF 16V  [CAPC0805(2012)145_N]
DS1  LTST-C191KGKT  [LITE-ON-LTST-C191KRKT-2_V]
P1  640456-4  [TECO-640456-4]
R25  10K  [RESC2013X70X40ML20T20]
R26  10K  [RESC2013X70X40ML20T20]
R27  1K  [RESC0603(1608)_M]
TP13  5019  [KSTN-5019_V]
TP14  5019  [KSTN-5019_V]
U10  OPA337UA/2K5  [D0008A_N]  (part A of 2)

### Blocks framed on the sheet
TESTPOINTS: TP13 TP14

### Ports
Control (in), Feedback (out), GND, SERVO_VCC

### Nets
GND: C26.1 P1.1 R26.1 R27.2 U10.4(V-) ; port GND
SERVO_VCC: DS1.1(A) P1.4 U10.7(V+) ; port SERVO_VCC  [project net V_5V]
Control: P1.2 TP14.1 ; port Control
Feedback: C26.2 TP13.1 U10.2(IN-) U10.6(OUT) ; port Feedback
NetDS1_2: DS1.2(K) R27.1
NetP1_3: P1.3 R25.2
NetR25_1: R25.1 R26.2 U10.3(IN+)

### Notes on the sheet
- Input voltage is 5V from the Boost converter. Feedback pin communicates with MCU via ADC. Control pin is PWM Output from MCU.

### Library data of the parts
C26 = CMP-1036-04889-1: as C8 on sheet FTDI; Technology: SMT; Value: 4.7uF; Rated Voltage: 16 V; Max Thickness: 1.45 mm
DS1 = CMP-2000-05198-1: as DS2 on sheet TM2_MAIN; Pin Count: 2; Lens Dimensions: 1.1X0.8X0.37mm; Packaging: TapeandReel; Main Category: ChipLED; Operating Temperature Classification: Industrial; Package Type: ChipLed; Mounting: SurfaceMount; Lum Intensity: 35mcd; Operating Temp Range: -55Cto85C; Datasheet Version: Jan-07; Datasheet URL: http://download.siliconexpert.com/pdfs/2007/08/26/semi_b/manual/lot/ds/ltst-c191kgkt.pdf; Manufacturer URL: http://www.us.liteon.com/
P1 = CMP-2000-05419-1: Male Header, Pitch 2.54 mm, 1 x 4 Position, Height 10.03 mm, Tail Length 3.56 mm, RoHS, Bulk; Manufacturer: TE Connectivity; Material, Housing: Polyester; Primary Type: InterconnectSystem; Mount Angle: Vertical; Color, Housing: White; Current, Rating: 5 / A; Agency Approvals: CSA,UL; Contact Termination Area Plating: Tin; Temperature, Operating: -55to+105 / degC; Standards: RoHSCompliant,ELVCompliant,UL94V-0; Number of Positions: 4; Brand/Series: MTA-100Series; Angle: Straight; Pin Spacing: 0.1 / "; Material, Contact: CopperAlloy; Connector Type: MTA-100; Special Features: Pinstrip; Mounting Hole Size: 0.04 / "; Contact Centerline Spacing: 0.100 / in.; Voltage, Rating: 250 / V; Manufacturer URL: http://www.te.com/; Length, Pin: 0.14 / "; Length, Overall: 0.4 / "; Color: White; Flammability Rating: UL94V-0; Mounting Type: PCMount; Termination: Solder; Datasheet URL: https://datasheet.ciiva.com/16286/eng-ds-82056-mta-0608-16286228.pdf; Number of Contacts: 4; Contact Shape: Square; Contact Mating Area Plating: Tin; Length, Terminal Post: 0.14 / in.; Size, Post: 0.025 / in.; Contact Plating: Tin; Type: PCBPlug; Datasheet Version: Dec-14; Number of Rows: 1
R25 R26 = CMP-2001-04376-1: Manufacturer: Panasonic; Part Number: ERJ-6ENF1002V
R27 = CMP-1012-00510-1: as R33 on sheet TM2_MAIN; Technology: SMT; Tolerance: 1 %; Power: 0.1 W
TP13 TP14 = CMP-1672-00008-1: as TP15 on sheet TM2_MAIN; ComponentLink1Description: Manufacturer URL; Package Quantity: 1000; DatasheetVersion: 03/2014; Packaging: Tape and Reel; ComponentLink2URL: http://www.keyelco.com/product-pdf.cfm?p=1357; ComponentLink1URL: http://www.keyelco.com/; Mount: Surface Mount; Contact Plating: Silver; PackageDescription: 1-Pin Surface Mount Device, Body 3.81 x 2.03 mm; Pins: 1; RoHSCompliant: True; Mounting Technology: Surface Mount; ComponentLink2Description: Datasheet; PackageReference: 5019
U10 = CMP-0272-00397-3: MicroSIZE, Single-Supply CMOS Operational Amplifier MicroAmplifier(TM) Series, 2.5 to 5.5 V, -40 to 85 degC, 8-pin SOIC (D8), Green (RoHS & no Sb/Br); Manufacturer: Texas Instruments; Total Supply Voltage(Min)(+5V is 5, +/-5V is 10): 2.5; CMRR(Min)(dB): 74; Rating: Catalog; Vio (25C)(Max)(mV): 3; IIB(Max)(pA): 10; Packing: LARGE T&R; Sub Family: Low Input Bias Current Amp (<=10pA), Low Supply Voltage Amplifier (<=2.7V), Precision Amplifier; Number of Channels: 1; Slew Rate(Typ)(V/us): 1.2; Offset Drift(Typ)(uV/C): 2; Total Supply Voltage(Max)(+5V is 5, +/-5V is 10): 5.5; DatasheetVersion: SBOS077B; Mounting Technology: Surface Mount; PackageVersion: 4040047-3/M, 06/2011; ComponentLink1Description: Manufacturer URL; Eco-Plan: Green (RoHS & no Sb/Br); PartNumber: OPA337UA/2K5; ComponentLink3Description: Package Specification; ComponentLink2Description: Datasheet; GBW(Typ)(MHz): 3; ComponentLink2URL: http://www.ti.com/lit/ds/symlink/opa337.pdf; PackageReference: D0008A; ComponentLink1URL: http://www.ti.com/; Code_JEDEC: MS-012; ComponentLink3URL: http://www.ti.com/litv/pdf/msoi002j; PackageDescription: 8-Pin Plastic Small Outline, Body 4.9 x 3.9 mm, Pitch 1.27 mm; Iq per channel(Max)(mA): 1

## Sheet LiPo_Charger.SchDoc
size A
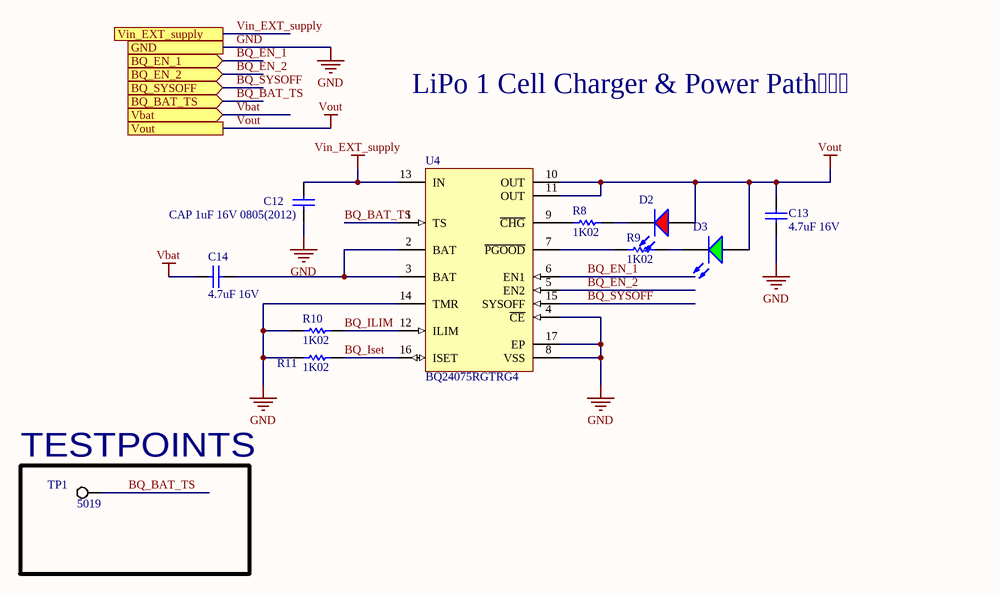
[diagram p7: LiPo_Charger.SchDoc]

### Parts
C12  CAP 1uF 16V 0805(2012)  [CAPC0805(2012)100_L]
C13  4.7uF 16V  [CAPC0805(2012)145_N]
C14  4.7uF 16V  [CAPC0805(2012)145_N]
D2  (no value)  [LTST-C170CKT_V]
D3  (no value)  [LTST-C170GKT_V]
R8  1K02  [RESC0603(1608)_N]
R9  1K02  [RESC0603(1608)_N]
R10  1K02  [RESC0603(1608)_N]
R11  1K02  [RESC0603(1608)_N]
TP1  5019  [KSTN-5019_V]
U4  BQ24075RGTRG4  [RGT16-1700X1700TP]

### Blocks framed on the sheet
TESTPOINTS: TP1

### Ports
BQ_BAT_TS (in), BQ_EN_1 (in), BQ_EN_2 (in), BQ_SYSOFF (in), GND, Vbat (in), Vin_EXT_supply, Vout

### Nets
GND: C12.1 C13.1 R10.1 R11.1 U4.4(~{CE}) U4.8(VSS) U4.14(TMR) U4.17(EP) ; port GND
Vbat: C14.2 ; port Vbat
Vin_EXT_supply: C12.2 U4.13(IN) ; port Vin_EXT_supply  [project net VUSB]
Vout: C13.2 D2.A D3.1(A) U4.10(OUT) U4.11(OUT) ; port Vout  [project net Vin]
BQ_BAT_TS: TP1.1 U4.1(TS) ; port BQ_BAT_TS
BQ_EN_1: U4.6(EN1) ; port BQ_EN_1
BQ_EN_2: U4.5(EN2) ; port BQ_EN_2
BQ_ILIM: R10.2 U4.12(ILIM)
BQ_Iset: R11.2 U4.16(ISET)
BQ_SYSOFF: U4.15(SYSOFF) ; port BQ_SYSOFF
NetC14_1: C14.1 U4.2(BAT) U4.3(BAT)
NetD2_C: D2.C R8.2
NetD3_2: D3.2(K) R9.2
NetR8_1: R8.1 U4.9(~{CHG})
NetR9_1: R9.1 U4.7(~{PGOOD})

### Notes on the sheet
- LiPo 1 Cell Charger & Power Path

### Library data of the parts
C12 = CMP-1036-04749-1: CAP 1uF 16V ±20% 0805 (2012 Metric) Thickness 1mm SMD; Case-EIA: 0805; Case-Metric: 2012; Tolerance: Â±20%; Value: 1uF; Rated Voltage: 16 V; Max Thickness: 1 mm; Technology: SMT
C13 C14 = CMP-1036-04889-1: as C8 on sheet FTDI; Technology: SMT; Value: 4.7uF; Rated Voltage: 16 V; Max Thickness: 1.45 mm
D2 = CMP-1674-00001-3: as D4 on sheet MCU; PackageReference: C170CKT; ComponentLink1Description: Datasheet; ComponentLink1URL: http://media.digikey.com/pdf/Data%20Sheets/Lite-On%20PDFs/LTST-C170CKT.pdf
D3 = CMP-1674-00002-4: LED Uni-Color Green, 100 mW, 120 mA, -55 to 85 degC, 2-Pin SMD, RoHS, Tape and Reel; DatasheetVersion: 03/2003; Package Quantity: 1; Pins: 2; Mounting Technology: Surface Mount; Mount: Surface Mount; PackageReference: C170GKT; PackageDescription: 2-Pin Surface Mount Device, Body 2 x 1.25 mm; Colour: Green; Packaging: Tape and Reel; Height: 1.1 mm; Max Operating Temperature: 85 degC; Length: 2 mm; RoHSCompliant: true; Min Operating Temperature: -55 degC
R8-R11 = CMP-1012-00511-1: 1K02 0.1W 1% 0603 (1608 Metric)  SMD; Value: 1020.00 Ohm; Case-EIA: 0603; Case-Metric: 1608; Technology: SMT; Power: 0.1 W; Tolerance: 1 %
TP1 = CMP-1672-00008-1: as TP15 on sheet TM2_MAIN; ComponentLink1Description: Manufacturer URL; Package Quantity: 1000; DatasheetVersion: 03/2014; Packaging: Tape and Reel; ComponentLink2URL: http://www.keyelco.com/product-pdf.cfm?p=1357; ComponentLink1URL: http://www.keyelco.com/; Mount: Surface Mount; Contact Plating: Silver; PackageDescription: 1-Pin Surface Mount Device, Body 3.81 x 2.03 mm; Pins: 1; RoHSCompliant: True; Mounting Technology: Surface Mount; ComponentLink2Description: Datasheet; PackageReference: 5019
U4 = CMP-0321-00237-1: USB-Friendly Li-Ion Battery Charger and Power-Path Management IC, Vout 5.5 V, 4.3 V, -40 to 85 degC, 16-pin QFN (RGT), Green (RoHS & no Sb/Br); Manufacturer: Texas Instruments; Li-Ion: N; SubFamily: Battery Charge Management; Vin(Min)(V): 4.3; ComponentLink1URL: http://www.ti.com/general/docs/lit/getliterature.tsp?genericPartNumber=BQ24075&fileType=pdf; Over Voltage Protection: N; PackageDescription: 16-Pin Plastic Quad Flat No-Lead, 3 x 3 mm Body, 0.5 mm Pitch, 1.7 x 1.7 mm Exposed Pad; NiMH: N; Li-Polymer: N; Eco-Plan: Green (RoHS & no Sb/Br); Code_JEDEC: MO-220; Lead Acid: N; PartNumber: BQ24075RGTRG4; ComponentLink1Description: Datasheet; Mounting Technology: Surface Mount; PackageVersion: revH, Oct-2011; PackageReference: RGT16-1700X1700TP; NiCd: N; DatasheetVersion: SLUS810G

## Sheet LiPo_fuel_guage.SchDoc
size A
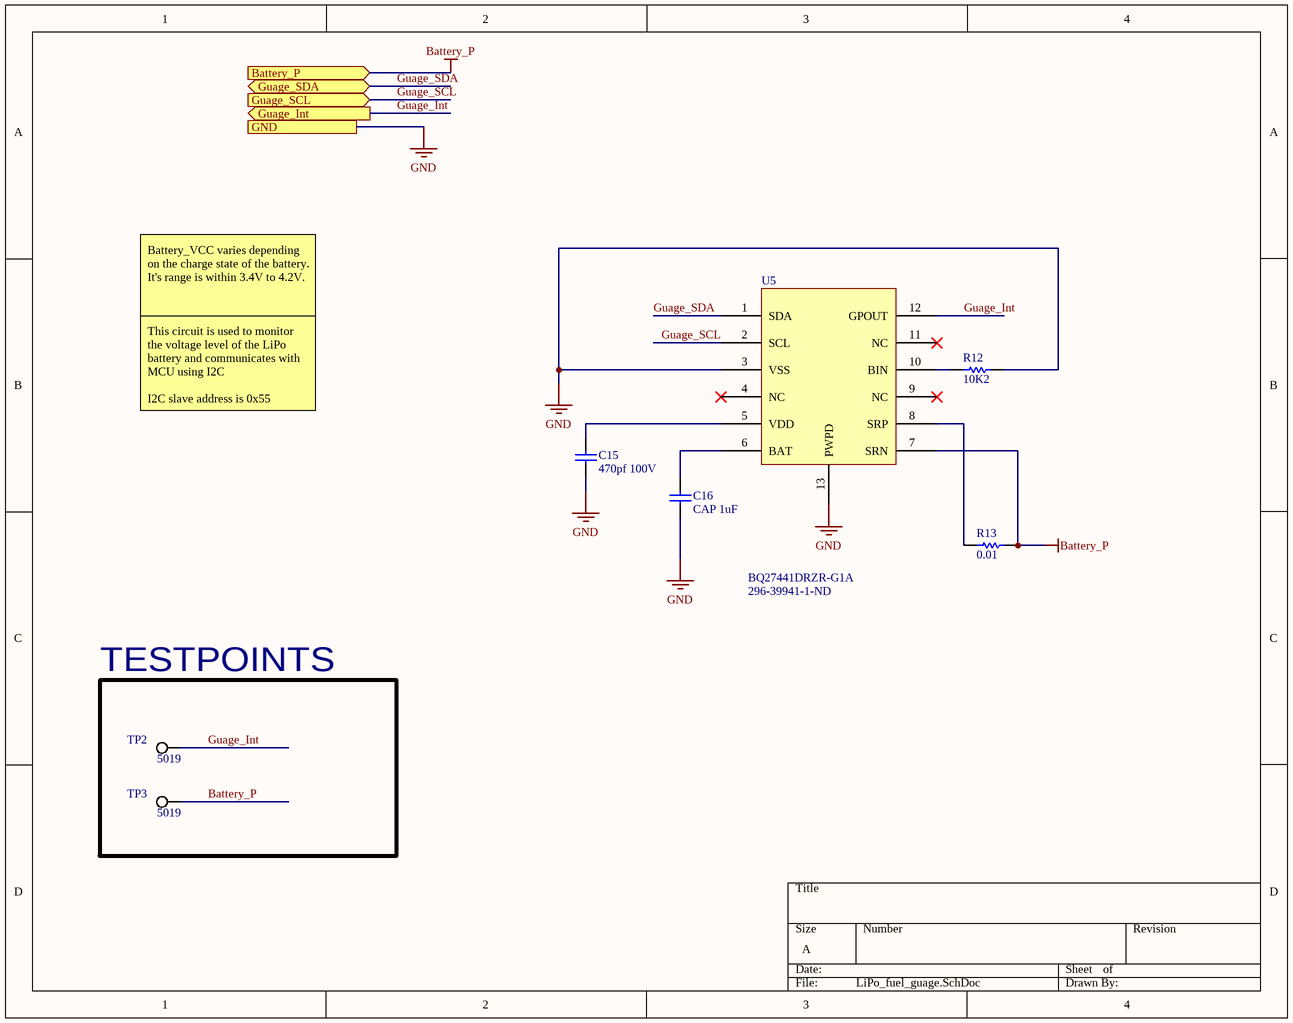
[diagram p8: LiPo_fuel_guage.SchDoc]

### Parts
C15  470pf 100V  [CAPC2013X70X45LL10T25]
C16  CAP 1uF  [CAPC0805(2012)100_L]
R12  10K2  [RESC0805(2012)_L]
R13  0.01  [RESC3216X70X50LL05T20]
TP2  5019  [KSTN-5019_V]
TP3  5019  [KSTN-5019_V]
U5  BQ27441DRZR-G1A  Supplier Part Number 1: 296-39941-1-ND  [*SON40P400X250X100-13N]

### Blocks framed on the sheet
TESTPOINTS: TP2 TP3

### Ports
Battery_P (in), GND, Guage_Int (out), Guage_SCL (in), Guage_SDA (bidir)

### Nets
Battery_P: R13.2 TP3.1 U5.7(SRN) ; port Battery_P  [project net Vbat]
GND: C15.1 C16.1 R12.1 U5.3(VSS) U5.13(PWPD) ; port GND
Guage_Int: TP2.1 U5.12(GPOUT) ; port Guage_Int
Guage_SCL: U5.2(SCL) ; port Guage_SCL  [project net SCL_2]
Guage_SDA: U5.1(SDA) ; port Guage_SDA  [project net SDA_2]
NetC15_2: C15.2 U5.5(VDD)
NetC16_2: C16.2 U5.6(BAT)
NetR12_2: R12.2 U5.10(BIN)
NetR13_1: R13.1 U5.8(SRP)

Not connected (* = marked no-connect by the designer): U5 4(NC)* 9(NC)* 11(NC)*

### Notes on the sheet
- Battery_VCC varies depending on the charge state of the battery. It's range is within 3.4V to 4.2V.
- This circuit is used to monitor the voltage level of the LiPo battery and communicates with MCU using I2C
  I2C slave address is 0x55

### Library data of the parts
C15 = CMP-2007-00930-1: Manufacturer: Murata; Part Number: GRM2165C2A471JA01D
C16 = CMP-1036-04749-1: as C12 on sheet LiPo_Charger; Value: 1uF; Rated Voltage: 16 V; Max Thickness: 1 mm; Technology: SMT
R12 = CMP-1013-00624-1: as R29 on sheet TM2_MAIN; Technology: SMT; Tolerance: 1 %; Power: 0.125 W
R13 = CMP-2003-00764-1: Part Number: ERJ8BWFR010V; Manufacturer: Panasonic
TP2 TP3 = CMP-1672-00008-1: as TP15 on sheet TM2_MAIN; ComponentLink1Description: Manufacturer URL; Package Quantity: 1000; DatasheetVersion: 03/2014; Packaging: Tape and Reel; ComponentLink2URL: http://www.keyelco.com/product-pdf.cfm?p=1357; ComponentLink1URL: http://www.keyelco.com/; Mount: Surface Mount; Contact Plating: Silver; PackageDescription: 1-Pin Surface Mount Device, Body 3.81 x 2.03 mm; Pins: 1; RoHSCompliant: True; Mounting Technology: Surface Mount; ComponentLink2Description: Datasheet; PackageReference: 5019
U5 = BQ27441DRZR-G1A: Manufacturer: Texas Instruments; Number of Cells: 1; Interface: I2C; Capacity: 8000mAh; Output Voltage: 600mV; Output Current: 500uA; Operating Supply Voltage: 4.5V; Supplier 1: Digi-Key; Manufacturer Part Number: BQ27441DRZR-G1A; RoHS: Yes; Stock 1: 20268; Pricing 1: 1 = 2.62000, 10 = 2.35300, 100 = 1.89110, 500 = 1.55376, 1000 = 1.28740 (USD); Mount: Surface Mount; Case/Package: QFN; Number of Pins: 12; Contact Plating: Gold; Min Operating Temperature: -40°C; Max Operating Temperature: 85°C; Package Quantity: 3000; Packaging: Tape and Reel; Lead Free: Lead Free